# EAGLE design Launch_Tower_Power_Interface_Board_v1-4 (EAGLE 6.4)
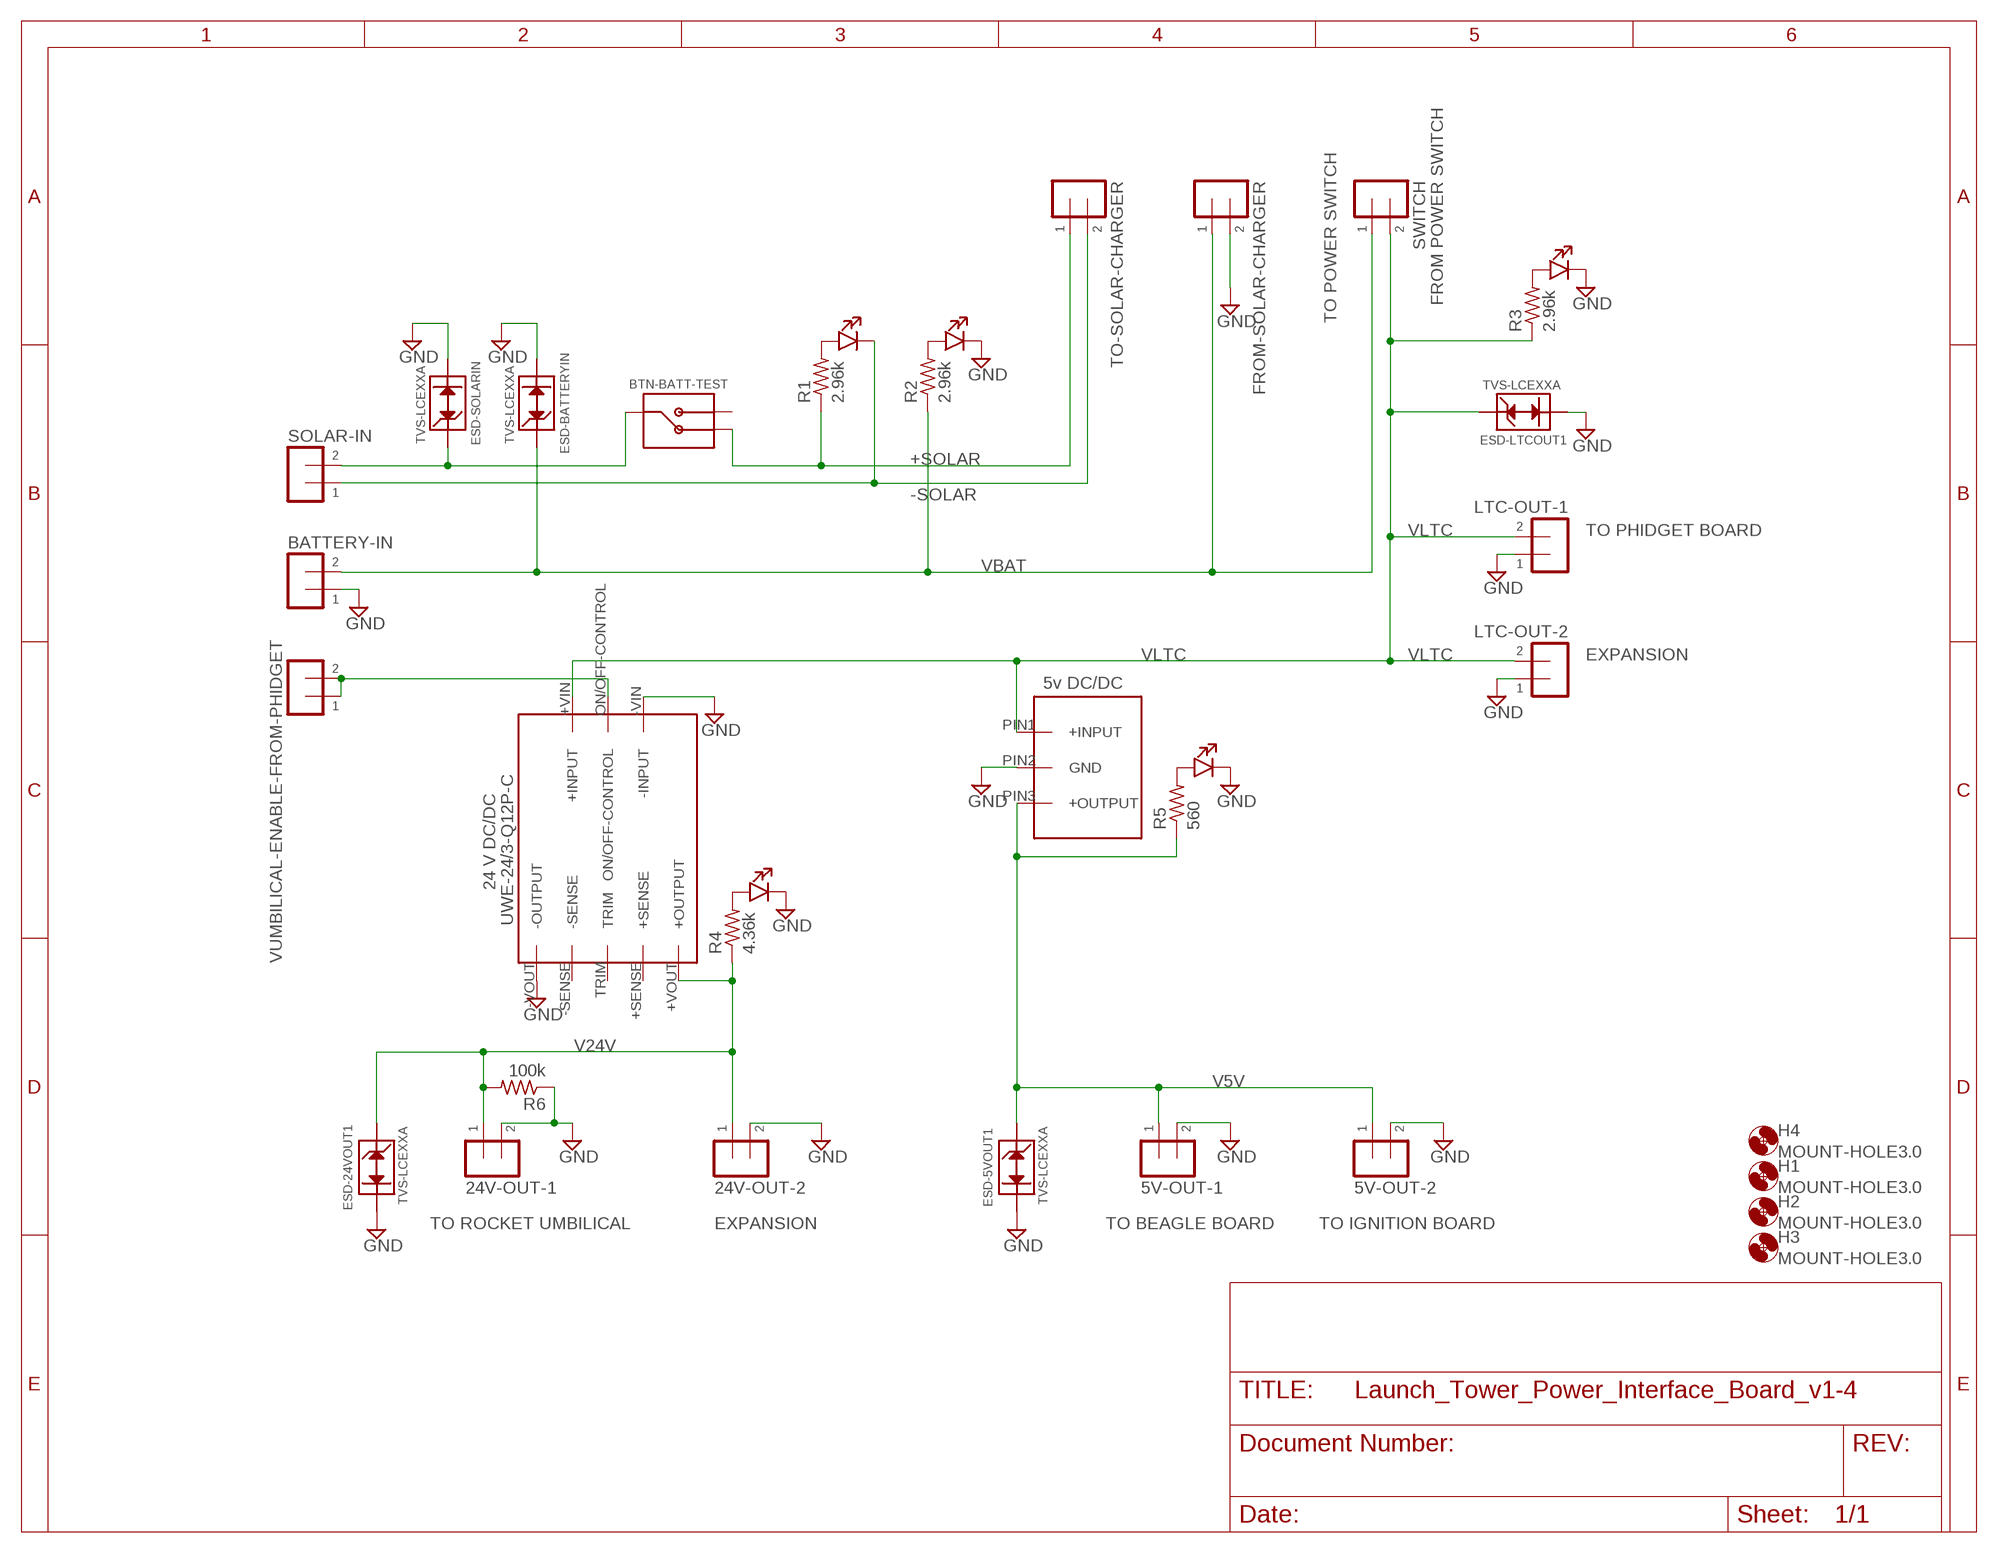
[diagram p0: schematic, sheet 1]

## Parts
5V-OUT-1  SCREW-TERMINAL-5MM  [SCREW-TERM-5MM]
5V-OUT-2  SCREW-TERMINAL-5MM  [SCREW-TERM-5MM]
24V-OUT-1  SCREW-TERMINAL-5MM  [SCREW-TERM-5MM]
24V-OUT-2  SCREW-TERMINAL-5MM  [SCREW-TERM-5MM]
BATTERY-IN  SCREW-TERMINAL-5MM  [SCREW-TERM-5MM]
BTN-BATT-TEST  BUTTON-107-3006-EVX  [BUTTON-1]
DC1  DC/DC_CONV_5V  [OKI-SIP]
DC2  UWE-24/3-Q12P-C  DC/DC_CONV_24V  [UWE]
ESD-5VOUT1  TVS-LCEXXA  [D0-201]
ESD-24VOUT1  TVS-LCEXXA  [D0-201]
ESD-BATTERYIN  TVS-LCEXXA  [D0-201]
ESD-LTCOUT1  TVS-LCEXXA  [D0-201]
ESD-SOLARIN  TVS-LCEXXA  [D0-201]
FROM-SOLAR-CHARGER  SCREW-TERMINAL-5MM  [SCREW-TERM-5MM]
H1  MOUNT-HOLE3.0  [3,0]
H2  MOUNT-HOLE3.0  [3,0]
H3  MOUNT-HOLE3.0  [3,0]
H4  MOUNT-HOLE3.0  [3,0]
LED-5V-DC/DC  LED-550-XX04  [LED-550]
LED-24V-DC/DC  LED-550-XX04  [LED-550]
LED-BATTERY-IN  LED-550-XX04  [LED-550]
LED-SOLAR-IN  LED-550-XX04  [LED-550]
LED-SWITCH-IN  LED-550-XX04  [LED-550]
LTC-OUT-1  SCREW-TERMINAL-5MM  [SCREW-TERM-5MM]
LTC-OUT-2  SCREW-TERMINAL-5MM  [SCREW-TERM-5MM]
R1  2.96k  R-US_0805-B  [0805-B]
R2  2.96k  R-US_0805-B  [0805-B]
R3  2.96k  R-US_0805-B  [0805-B]
R4  4.36k  R-US_0805-B  [0805-B]
R5  560  R-US_0805-B  [0805-B]
R6  100k  R-US_0805-B  [0805-B]
SOLAR-IN  SCREW-TERMINAL-5MM  [SCREW-TERM-5MM]
SWITCH  SCREW-TERMINAL-5MM  [SCREW-TERM-5MM]
TO-SOLAR-CHARGER  SCREW-TERMINAL-5MM  [SCREW-TERM-5MM]
VUMBILICAL-ENABLE-FROM-PHIDGET  SCREW-TERMINAL-5MM  [SCREW-TERM-5MM]

## Nets
+SOLAR: BTN-BATT-TEST.NC R1.1 TO-SOLAR-CHARGER.1
-SOLAR: LED-SOLAR-IN.CATHODE SOLAR-IN.1 TO-SOLAR-CHARGER.2
GND: 5V-OUT-1.2 5V-OUT-2.2 24V-OUT-1.2 24V-OUT-2.2 BATTERY-IN.1 DC1.PIN2(GND) DC2.-VIN(-INPUT) DC2.-VOUT(-OUTPUT) ESD-5VOUT1.CATHODE ESD-24VOUT1.CATHODE ESD-BATTERYIN.CATHODE ESD-LTCOUT1.CATHODE ESD-SOLARIN.CATHODE FROM-SOLAR-CHARGER.2 LED-5V-DC/DC.CATHODE LED-24V-DC/DC.CATHODE LED-BATTERY-IN.CATHODE LED-SWITCH-IN.CATHODE LTC-OUT-1.1 LTC-OUT-2.1 R6.1
GPIO: DC2.ON/OFF-CONTROL VUMBILICAL-ENABLE-FROM-PHIDGET.1 VUMBILICAL-ENABLE-FROM-PHIDGET.2
N$1: LED-SOLAR-IN.ANODE R1.2
N$2: LED-BATTERY-IN.ANODE R2.2
N$3: LED-SWITCH-IN.ANODE R3.2
N$4: LED-5V-DC/DC.ANODE R5.2
N$5: LED-24V-DC/DC.ANODE R4.2
N$6: BTN-BATT-TEST.COMMON ESD-SOLARIN.ANODE SOLAR-IN.2
V5V: 5V-OUT-1.1 5V-OUT-2.1 DC1.PIN3(+OUTPUT) ESD-5VOUT1.ANODE R5.1
V24V: 24V-OUT-1.1 24V-OUT-2.1 DC2.+VOUT(+OUTPUT) ESD-24VOUT1.ANODE R4.1 R6.2
VBAT: BATTERY-IN.2 ESD-BATTERYIN.ANODE FROM-SOLAR-CHARGER.1 R2.1 SWITCH.1
VLTC: DC1.PIN1(+INPUT) DC2.+VIN(+INPUT) ESD-LTCOUT1.ANODE LTC-OUT-1.2 LTC-OUT-2.2 R3.1 SWITCH.2
Unconnected: BTN-BATT-TEST.NO DC2.+SENSE DC2.-SENSE DC2.TRIM

## Notes on the sheet
- FROM POWER SWITCH
- TO POWER SWITCH
- TO PHIDGET BOARD
- EXPANSION
- 5v DC/DC
- 24 V DC/DC
- UWE-24/3-Q12P-C
- TO ROCKET UMBILICAL | EXPANSION | TO BEAGLE BOARD | TO IGNITION BOARD

## Library data of the parts
5V-OUT-1 5V-OUT-2 24V-OUT-1 24V-OUT-2 BATTERY-IN FROM-SOLAR-CHARGER LTC-OUT-1 LTC-OUT-2 SOLAR-IN SWITCH TO-SOLAR-CHARGER VUMBILICAL-ENABLE-FROM-PHIDGET = launch-tower:SCREW-TERMINAL-5MM
BTN-BATT-TEST = launch-tower:BUTTON-107-3006-EVX
DC1 = launch-tower:DC/DC_CONV_5V
DC2 = launch-tower:DC/DC_CONV_24V
ESD-5VOUT1 ESD-24VOUT1 ESD-BATTERYIN ESD-LTCOUT1 ESD-SOLARIN = launch-tower:TVS-LCEXXA
H1-H4 = holes:MOUNT-HOLE: MOUNTING HOLE with drill center marker
LED-5V-DC/DC LED-24V-DC/DC LED-BATTERY-IN LED-SOLAR-IN LED-SWITCH-IN = launch-tower:LED-550-XX04
R1-R6 = rcl_custom:R-US_: RESISTOR, American symbol

## Board
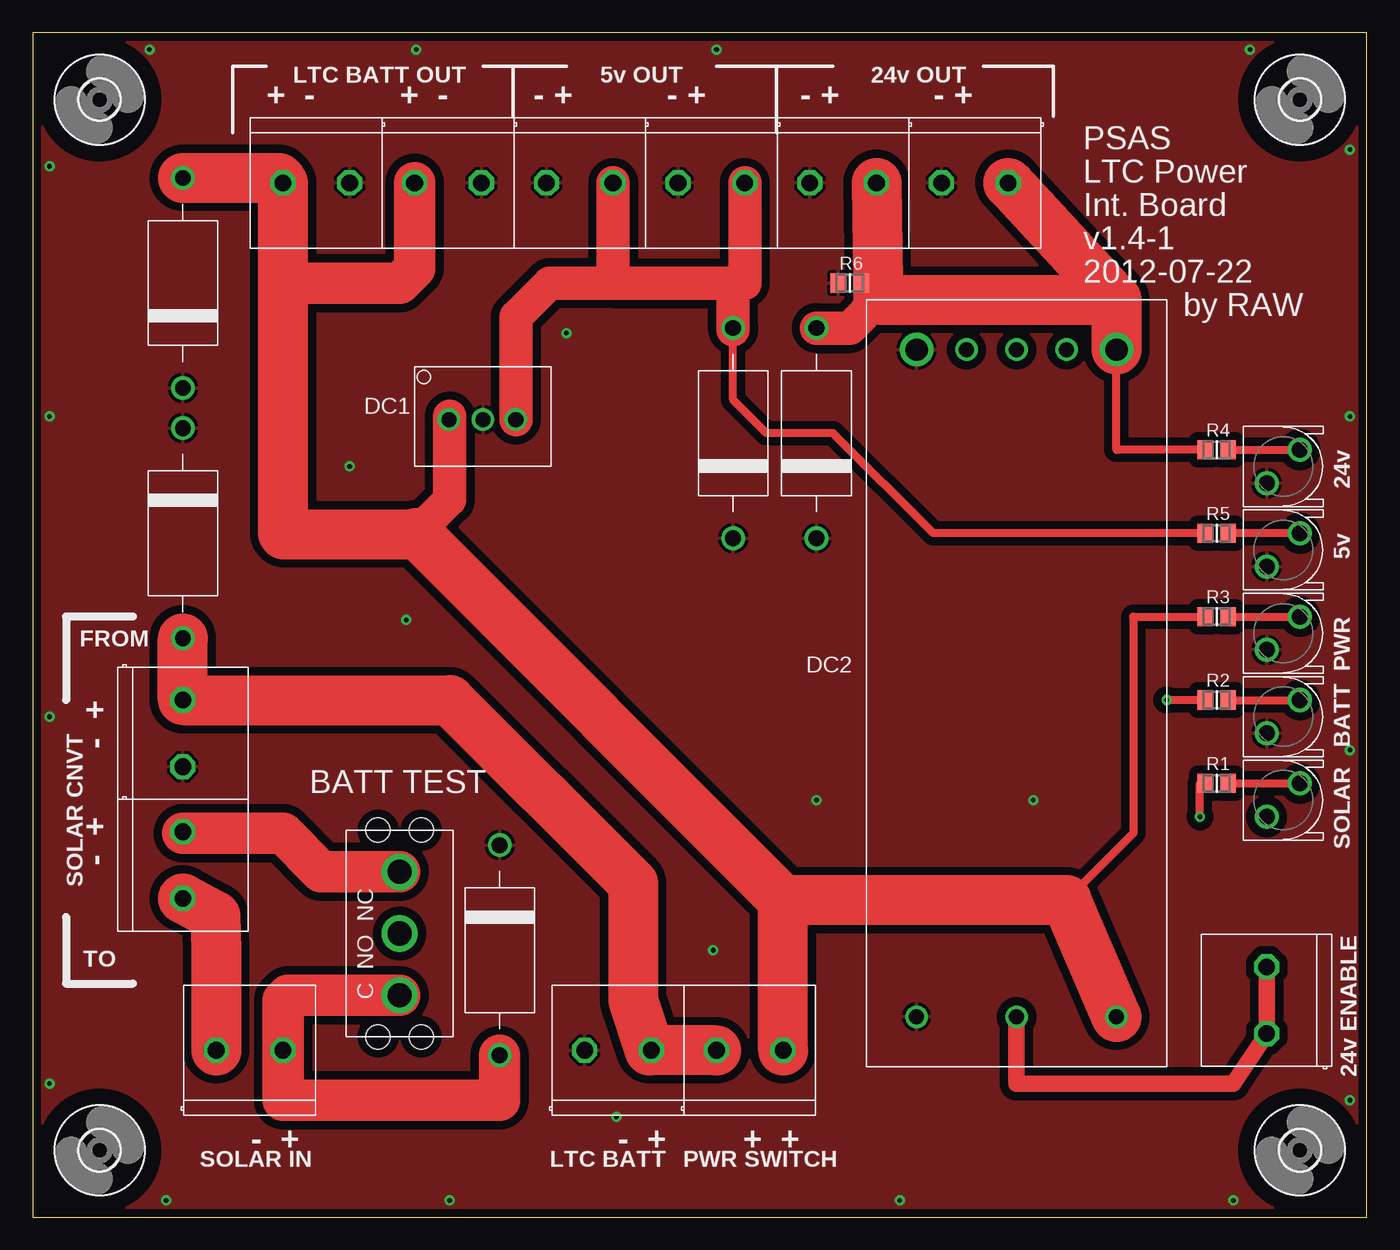
[diagram p1: board, top side]
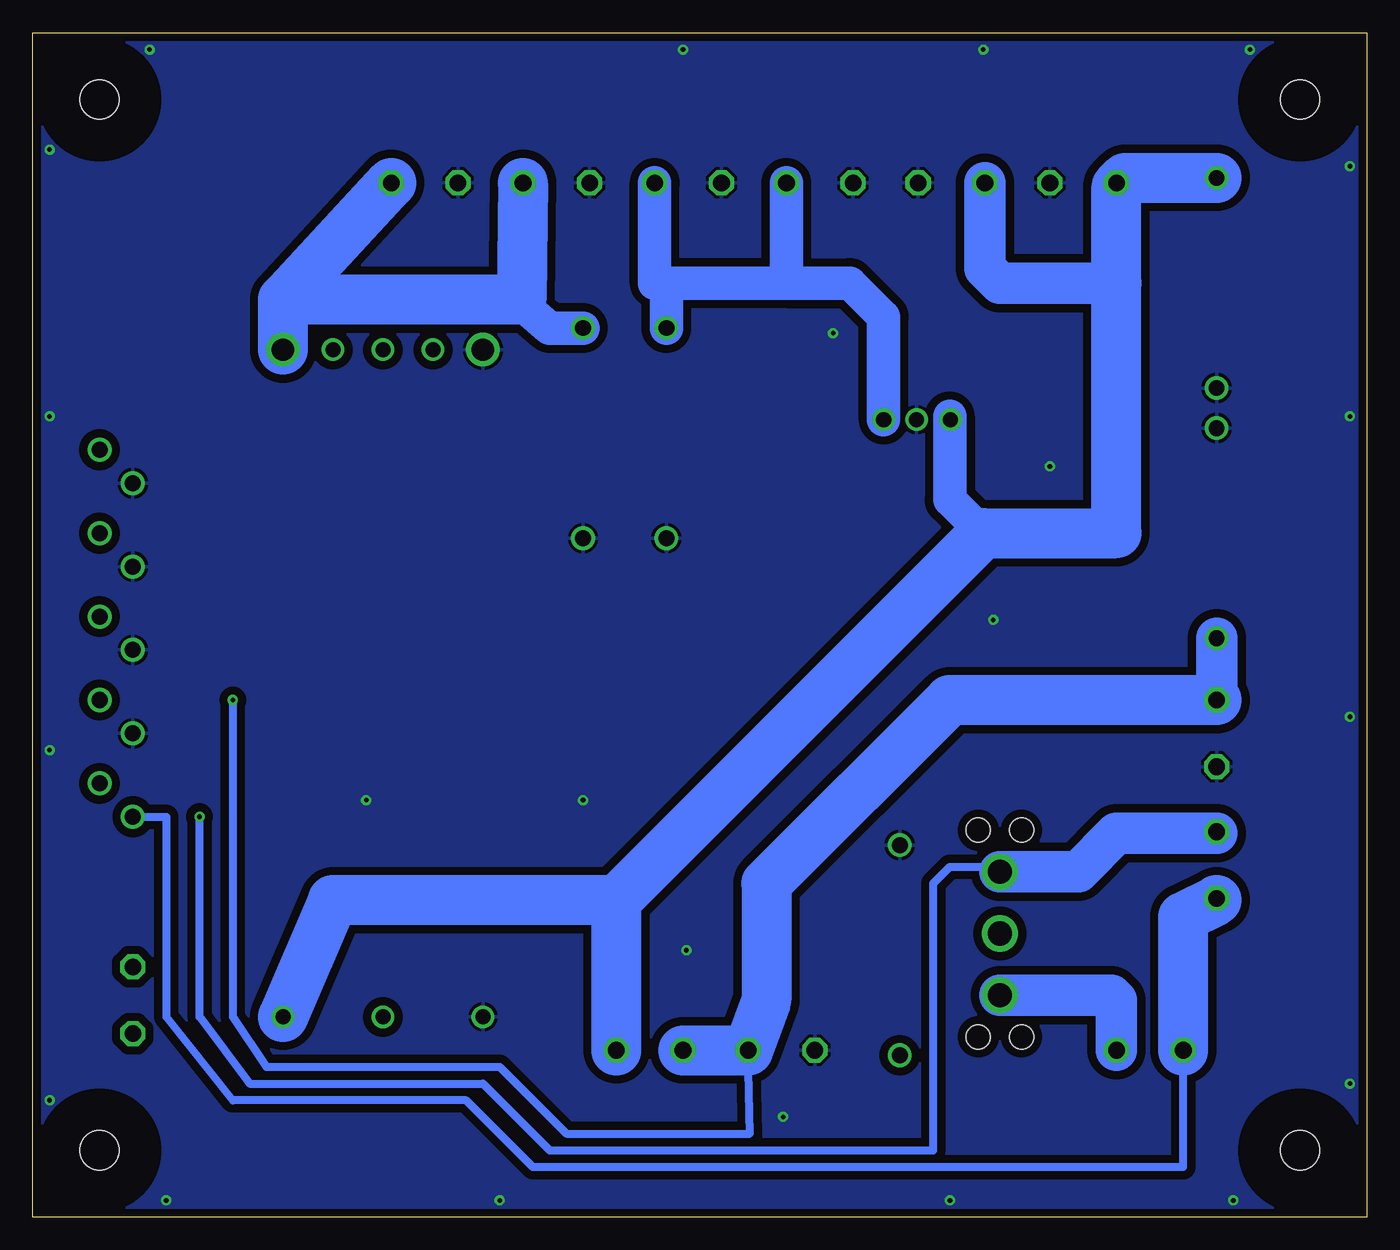
[diagram p2: board, bottom side, seen from below]

Size 101.6 x 90.17 mm. Coordinates in mm from the lower left corner, seen from the top.
Outline: 0,0 101.6,0 101.6,90.17 0,90.17 0,0
Copper layers (1*16): Top 0.0178mm / dielectric 59mil / Bottom 0.0178mm
Design rules "default": minimum track width 6mil, minimum drill 14mil, track to track 6mil, track to pad 6mil, pad to pad 6mil, via to via 6mil, smd to smd 6mil, copper to edge 20mil, drill to drill 16mil, minimum pad ring 8mil, minimum via ring 8mil, stop-mask expansion 3mil, vias tented up to drill 0mil, thermal gap 10mil

### Footprints (pad centres in the part's own frame; a part is rotated, then mirrored left to right if it is on the bottom)
SCREW-TERM-5MM = drill 1.27 octagon: 1 -2.54,0; 2 2.54,0
BUTTON-1 = drill 1.85: COMMON -4.7,0; NC 4.7,0; NO 0,0 | hole 1.85: -7.875,1.65; -7.875,-1.65; 7.875,1.65; 7.875,-1.65
OKI-SIP = drill 1.143: PIN1 -2.6,-0.25; PIN2 0,-0.25; PIN3 2.5,-0.25
UWE = drill 1.143: +SENSE 25.4,-3.81; +VIN -25.4,-7.62; -SENSE 25.4,3.81; -VIN -25.4,7.62; ON/OFF-CONTROL -25.4,0; TRIM 25.4,0 | drill 1.702: +VOUT 25.4,-7.62; -VOUT 25.4,7.62
D0-201 = drill 1.2: ANODE -8,0; CATHODE 8,0
3,0 = hole 3: 0,0
LED-550 = drill 1.22: ANODE 1.27,-1.27; CATHODE -1.27,1.27
0805-B = smd 1.15 x 1.45: 1 -0.9,0; 2 0.9,0

### Placement (x,y rotation side)
5V-OUT-1  41.66,78.74 180 top
5V-OUT-2  51.69,78.74 180 top
24V-OUT-1  61.72,78.74 180 top
24V-OUT-2  71.75,78.74 180 top
BATTERY-IN  44.58,12.7 0 top
BTN-BATT-TEST  27.94,21.59 90 top
DC1  34.29,60.96 0 top
DC2  74.93,40.64 90 top
ESD-5VOUT1  53.34,59.69 270 top
ESD-24VOUT1  59.69,59.69 270 top
ESD-BATTERYIN  11.43,52.07 90 top
ESD-LTCOUT1  11.43,71.12 270 top
ESD-SOLARIN  35.56,20.32 90 top
FROM-SOLAR-CHARGER  11.43,36.83 270 top
H1  5.08,85.09 0 top
H2  5.08,5.08 0 top
H3  96.52,5.08 0 top
H4  96.52,85.09 0 top
LED-5V-DC/DC  95.25,50.8 90 top
LED-24V-DC/DC  95.25,57.15 90 top
LED-BATTERY-IN  95.25,38.1 90 top
LED-SOLAR-IN  95.25,31.75 90 top
LED-SWITCH-IN  95.25,44.45 90 top
LTC-OUT-1  21.59,78.74 180 top
LTC-OUT-2  31.62,78.74 180 top
R1  90.17,33.02 0 top
R2  90.17,39.37 0 top
R3  90.17,45.72 0 top
R4  90.17,58.42 0 top
R5  90.17,52.07 0 top
R6  62.23,71.12 0 top
SOLAR-IN  16.51,12.7 0 top
SWITCH  54.61,12.7 0 top
TO-SOLAR-CHARGER  11.43,26.8 270 top
VUMBILICAL-ENABLE-FROM-PHIDGET  93.98,16.51 90 top

### Tracks (layer width: path | path; a pad name or v marks a point on that pad's centre or on a via)
+SOLAR  (via drill 0.36)
  Top 0.61: v88.9,30.48 88.9,33.02 R1.1
  Top 3.175: BTN-BATT-TEST.NC 21.97,26.29 19.05,29.21 11.43,29.21
  Bottom 0.61: v88.9,30.48 88.9,15.24 85.09,10.16 67.31,10.16 62.23,5.08 33.02,5.08 33.02,25.4 31.75,26.67 28.32,26.67 BTN-BATT-TEST.NC
  Bottom 1.27: 11.43,29.21 TO-SOLAR-CHARGER.1
  Bottom 3.175: BTN-BATT-TEST.NC 21.97,26.29 19.05,29.21 11.43,29.21
-SOLAR
  Top 3.81: TO-SOLAR-CHARGER.2 13.89,22.94 13.97,20.32 SOLAR-IN.1
  Bottom 0.61: SOLAR-IN.1 13.97,3.81 63.5,3.81 68.58,8.89 86.36,8.89 91.44,15.24 91.44,30.48 LED-SOLAR-IN.CATHODE
  Bottom 3.81: SOLAR-IN.1 13.97,22.86 11.43,24.13
GND  (via drill 0.36)
  other vias: 1.27,80.01 8.89,88.9 92.71,88.9 100.33,81.28 100.33,8.89 91.44,1.27 10.16,1.27 1.27,10.16 66.04,1.27 44.45,7.62 59.69,31.75 76.2,31.75 40.64,67.31 24.13,57.15 100.33,60.96 100.33,35.56 1.27,60.96 1.27,38.1 29.21,88.9 52.07,88.9 51.82,20.32 28.45,45.47 31.75,1.27
  pour Bottom (isolate 0.635): 0,90.17 101.6,90.17 101.6,0 0,0
  pour Top (isolate 0.635): 0,90.17 101.6,90.17 101.6,0 0,0
GPIO
  Top 1.27: VUMBILICAL-ENABLE-FROM-PHIDGET.2 VUMBILICAL-ENABLE-FROM-PHIDGET.1 91.44,10.16 74.93,10.16 DC2.ON/OFF-CONTROL
N$1
  Top 0.61: R1.2 LED-SOLAR-IN.ANODE
N$2
  Top 0.61: R2.2 LED-BATTERY-IN.ANODE
N$3
  Top 0.61: R3.2 LED-SWITCH-IN.ANODE
N$4
  Top 0.61: LED-5V-DC/DC.ANODE R5.2
N$5
  Top 0.61: R4.2 LED-24V-DC/DC.ANODE
N$6
  Top 3.175: ESD-SOLARIN.ANODE 35.56,8.89 19.05,8.89 SOLAR-IN.2 19.05,16.51 19.43,16.89 BTN-BATT-TEST.COMMON
  Bottom 3.175: BTN-BATT-TEST.COMMON 19.43,16.89 19.05,16.51 SOLAR-IN.2
V5V
  Top 0.61: R5.1 68.58,52.07 60.96,59.69 55.88,59.69 53.34,62.23 ESD-5VOUT1.ANODE
  Top 2.54: 44.2,71.12 53.34,71.12 | 53.34,71.12 54.23,71.12 5V-OUT-2.1 | 5V-OUT-1.1 44.2,71.12 | 53.34,67.56 ESD-5VOUT1.ANODE 53.34,71.12 | 44.2,71.12 39.37,71.12 36.79,68.54 DC1.PIN3
  Bottom 2.54: 44.2,71.12 5V-OUT-1.1 | 44.2,71.12 53.34,71.12 | 53.34,71.12 54.23,71.12 5V-OUT-2.1 | ESD-5VOUT1.ANODE 53.34,71.12 | 44.2,71.12 39.37,71.12 36.79,68.54 DC1.PIN3
V24V
  Top 0.61: DC2.+VOUT 82.55,58.42 R4.1 | R6.2 64.13,71.12 64.13,71.37
  Top 1.27: 64.13,71.37 64.37,71.13
  Top 2.54: ESD-24VOUT1.ANODE 62.23,67.69 64.39,69.85
  Top 3.81: 24V-OUT-1.1 64.37,71.13 64.39,69.85 82.55,69.85 | 82.55,69.85 DC2.+VOUT | 24V-OUT-2.1 82.55,69.85
  Bottom 2.54: ESD-24VOUT1.ANODE 62.23,67.69 64.77,69.85
  Bottom 3.81: DC2.+VOUT 82.55,69.85 | 82.55,69.85 24V-OUT-2.1 | 24V-OUT-1.1 64.39,69.85 64.77,69.85 82.55,69.85
VBAT  (via drill 0.36)
  Top 0.61: R2.1 v86.36,39.37
  Top 3.81: SWITCH.1 46.99,12.7 45.72,16.51 45.72,25.4 31.75,39.37 FROM-SOLAR-CHARGER.1 ESD-BATTERYIN.ANODE
  Bottom 0.61: v86.36,39.37 86.36,15.24 83.82,11.43 66.04,11.43 60.96,6.35 46.99,6.35 BATTERY-IN.2
  Bottom 3.175: ESD-BATTERYIN.ANODE FROM-SOLAR-CHARGER.1
  Bottom 3.81: SWITCH.1 BATTERY-IN.2 45.72,16.51 45.72,25.4 31.75,39.37 FROM-SOLAR-CHARGER.1
VLTC
  Top 0.61: 78.74,24.13 83.82,29.21 83.82,45.72 R3.1
  Top 2.54: 31.75,60.96 31.75,54.61 29.21,52.07
  Top 3.175: LTC-OUT-2.2 29.08,72.26 27.94,71.12 19.05,71.12
  Top 3.81: SWITCH.2 57.15,24.13 | 57.15,24.13 29.29,51.99 | 19.05,52.07 19.05,71.12 LTC-OUT-1.2 18.75,79.12 ESD-LTCOUT1.ANODE | DC2.+VIN 78.74,24.13 57.15,24.13 | 19.13,51.99 29.29,51.99 | 29.29,51.99 29.21,52.07
  Bottom 0.635: DC1.PIN1 31.69,60.9 31.75,60.96
  Bottom 2.54: 31.75,60.96 31.75,54.61 29.21,52.07
  Bottom 3.175: LTC-OUT-2.2 29.08,72.26 27.94,71.12 19.05,71.12
  Bottom 3.81: SWITCH.2 57.15,24.13 | 57.15,24.13 78.74,24.13 DC2.+VIN | 57.15,24.13 29.21,52.07 19.05,52.07 19.05,71.12 19.05,78.49 18.41,79.12 ESD-LTCOUT1.ANODE

### Text on the board
tPlace: LTC BATT OUT | 5v OUT | 24v OUT | - + | - + | + - | + - | + - | + - | PSAS | LTC Power | Int. Board | v1.4-1 | 2012-07-22 | by RAW | 24v | 5v | PWR | FROM | BATT | - + | SOLAR CNVT | SOLAR | BATT TEST | - + | TO | 24v ENABLE | + - | + - | + + | SOLAR IN | LTC BATT | PWR SWITCH